# EAGLE design MotherBoard rev1 (EAGLE 9.1.3)
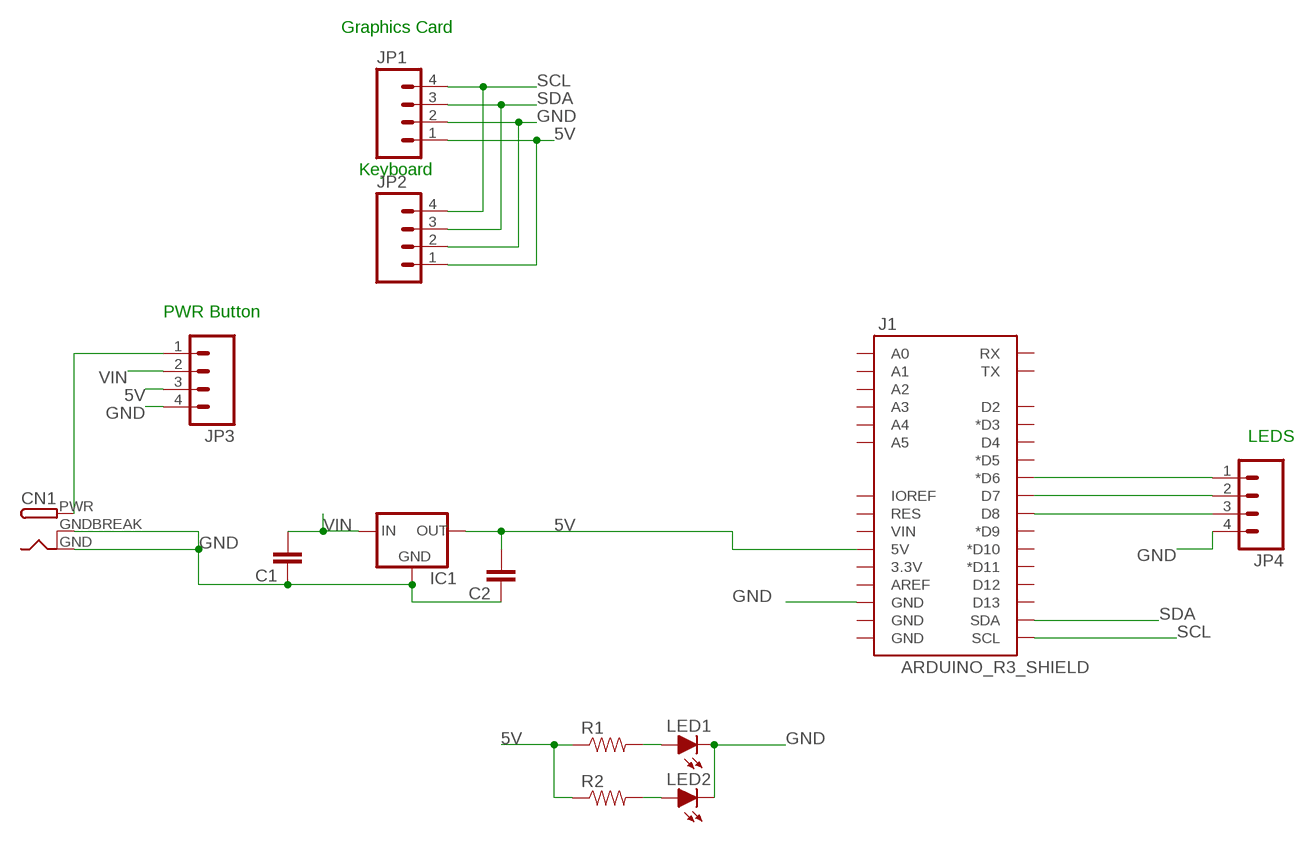
[diagram p0: schematic, sheet 1]

## Parts
C1  CAPPTH3  [CAP-PTH-LARGE]
C2  CAPPTH3  [CAP-PTH-LARGE]
CN1  DCBARRELPTH  [DCJACK_2MM_PTH]
IC1  5VREG_L7805SPACED  [TO-220-SPACED]
J1  ARDUINO_R3_SHIELD  [UNO_R3_SHIELD]
JP1  M04  [1X04]
JP2  M04  [1X04]
JP3  M04  [1X04]
JP4  M04  [1X04]
LED1  LED-5MM  [LED-5MM]
LED2  LED-5MM  [LED-5MM]
R1  RESISTORPTH-1/2W  [AXIAL-0.5]
R2  RESISTORPTH-1/2W  [AXIAL-0.5]

## Nets
5V: C2.2 IC1.3(OUT) J1.5V JP1.1 JP2.1 JP3.3 R1.P$1 R2.P$1
GND: C1.1 C2.1 CN1.GND CN1.GNDBREAK IC1.2(GND) J1.GND@2(GND) JP1.2 JP2.2 JP3.4 JP4.4 LED1.K(C) LED2.K(C)
N$1: LED1.A R1.P$2
N$2: LED2.A R2.P$2
N$3: CN1.PWR JP3.1
N$5: J1.D8 JP4.3
N$6: J1.D6(*D6) JP4.1
N$7: J1.D7 JP4.2
SCL: J1.SCL JP1.4 JP2.4
SDA: J1.SDA JP1.3 JP2.3
VIN: C1.2 IC1.1(IN) JP3.2
Unconnected: J1.3.3V J1.A0 J1.A1 J1.A2 J1.A3 J1.A4 J1.A5 J1.AREF J1.D2 J1.D3(*D3) J1.D4 J1.D5(*D5) J1.D9(*D9) J1.D10(*D10) J1.D11(*D11) J1.D12 J1.D13 J1.GND@0(GND) J1.GND@1(GND) J1.IOREF J1.RES J1.RX J1.TX J1.VIN

## Notes on the sheet
- Graphics Card
- Keyboard
- PWR Button
- LEDS

## Library data of the parts
C1 C2 = HyTechDevices:CAP: Capacitor Standard 0603 ceramic capacitor, and 0.1" leaded capacitor.
CN1 = HyTechDevices:DCBARREL: 2.0mm DC Barrel Jack DCJACK_2MM_PTH - Through Hole Jack (4UConnector: 05537) Source: Adafruit <https://github.com/adafruit/Adafruit-Eagle-Library>
IC1 = HyTechDevices:5VREG_L7805: Voltage Regulator Switching 5v regulator Datasheet <http://power.murata.com/data/power/oki-78sr.pdf> Standard 7805 5V regulator. IGO (Input Ground Output). Spark Fun Electronics SKU : COM-00107 Datasheet <http://www.mouser.com/ds/2/308/MC7800-D-94905.pdf>
J1 = HyTechDevices:ARDUINO_R3_SHIELD: Shield form compatible with the Arduino Uno R3. Source: Sparkfun <https://github.com/sparkfun/SparkFun-Eagle-Libraries>
JP1-JP4 = HyTechDevices:M04: Standard 4-pin 0.1" header. NOTES ON THE VARIANTS LOCK and LOCK_LONGPADS... This footprint was designed to help hold the alignment of a through-hole component (i.e. 6-pin header) while soldering it into place. You may notice that each hole has been shifted either up or down by 0.005 of an inch from it's more standard position (which is a perfectly straight line). This slight alteration caused the pins (the squares in the middle) to touch the edges of the holes. Because they are alternating, it causes a "brace" to hold the component in place. 0.005 has proven to be the perfect amount of "off-center" position when using our standard breakaway headers. Although looks a little odd when you look at the bare footprint, once you have a header in there, the alteration is very hard to notice. Also,if you push a header all the way into place, it is covered up entirely on the bottom side. This idea of altering the position of holes to aid alignment will be further integrated into the Sparkfun Library for other footprints. It can help hold any component with 3 or more connection pins. Note: The Sparkfun version includes many other packages including surface mount that may be of future interest. Source: Sparkfun <https://github.com/sparkfun/SparkFun-Eagle-Libraries>
LED1 LED2 = HyTechDevices:LED: Light Emitting Diode (LED) Source: Dangerous Prototypes Eagle Library <https://github.com/DangerousPrototypes/Eagle_Part_Library>
R1 R2 = HyTechDevices:RESISTOR: Resistor Basic schematic elements and footprints for 0603, 1206, and PTH resistors.

## Board
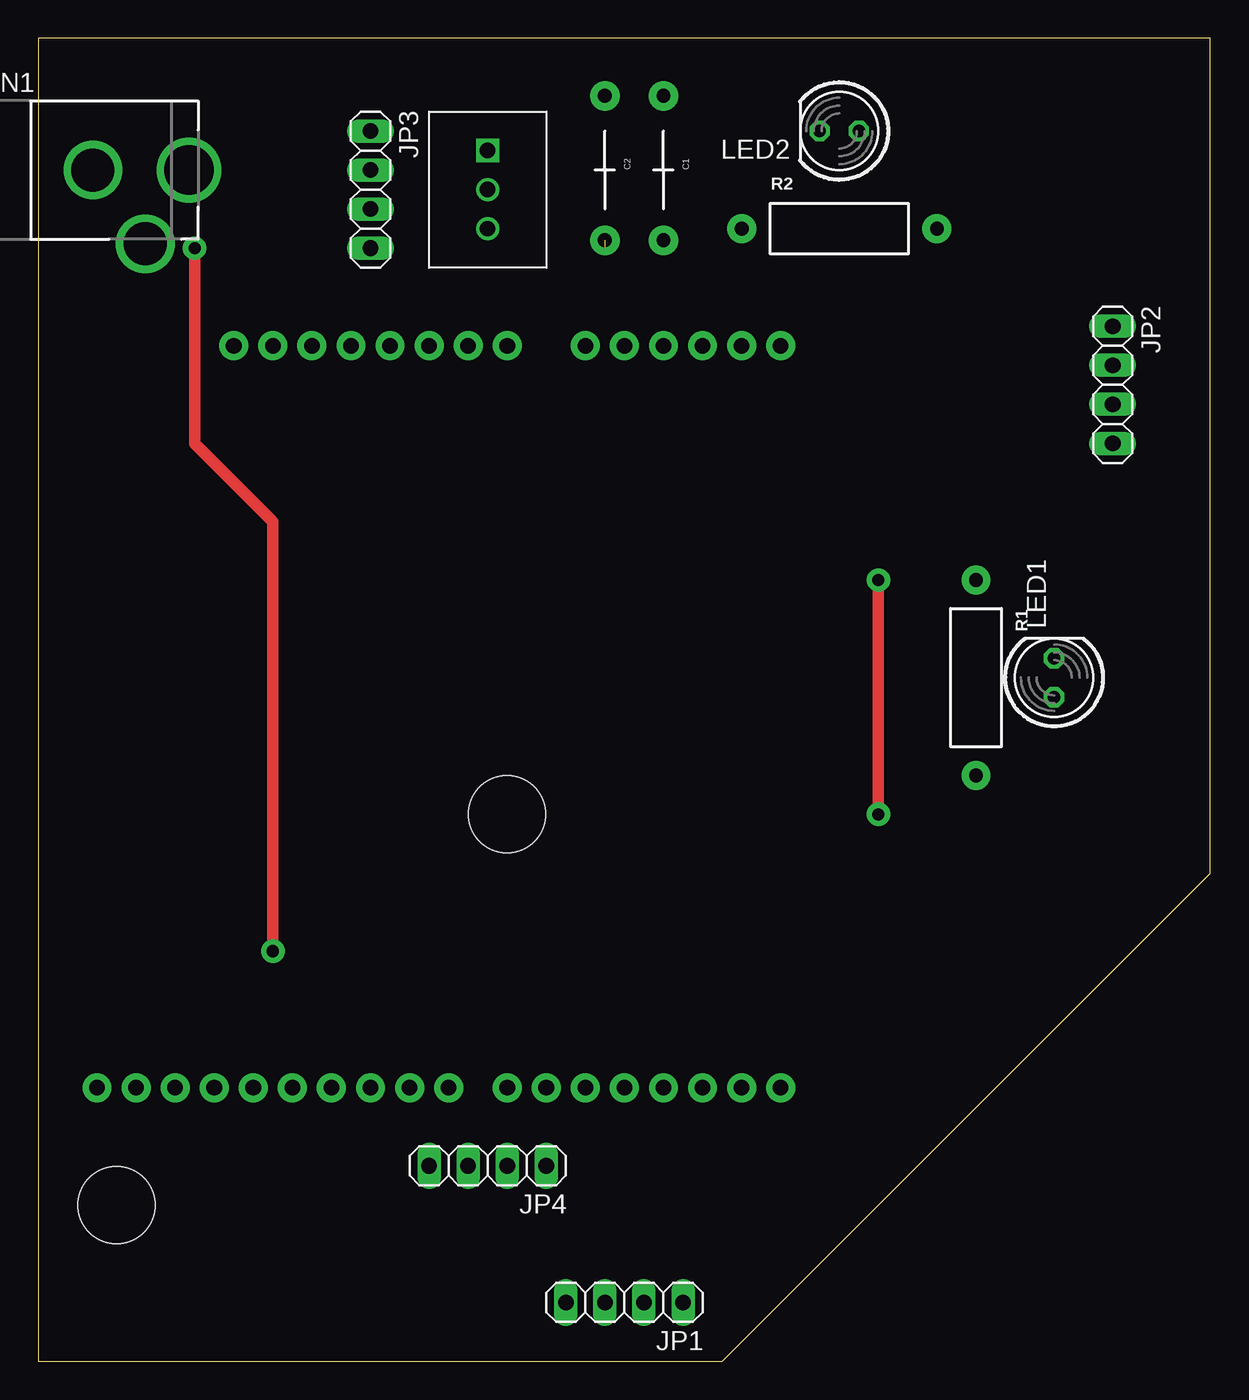
[diagram p1: board, top side]
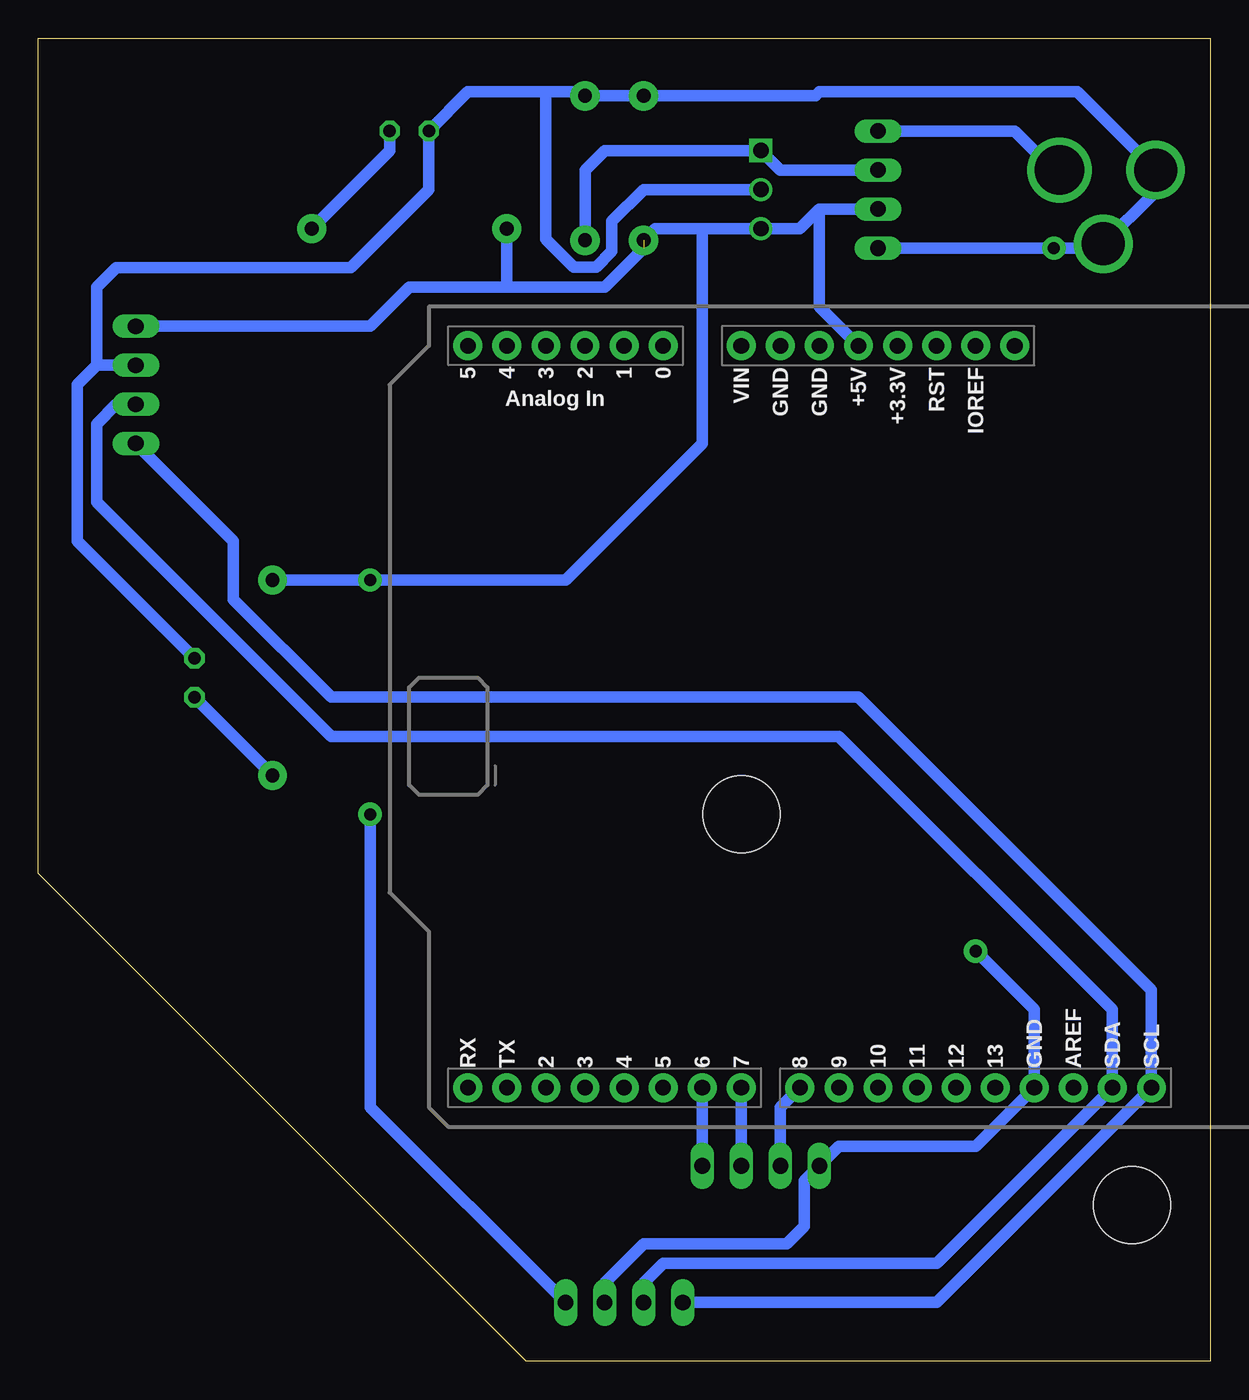
[diagram p2: board, bottom side, seen from below]

Size 76.18 x 86.03 mm. Coordinates in mm from the lower left corner, seen from the top.
Outline: 0,0 44.45,0 76.18,31.73 76.18,86.03 0,86.03 0,0
Copper layers (1*16): Top 0.035mm / dielectric 1.5mm / Bottom 0.035mm
Design rules "default *": minimum track width 6mil, minimum drill 0.35mm, track to track 16mil, track to pad 16mil, pad to pad 16mil, via to via 16mil, smd to smd 16mil, copper to edge 40mil, drill to drill 6mil, minimum pad ring 10mil, minimum via ring 8mil, stop-mask expansion 4mil, vias tented up to drill 0mil, thermal gap 10mil
Holes 0.35 mm at 80.01,38.1
Holes 5 mm at 5.08,10.16 30.48,35.56

### Footprints (pad centres in the part's own frame; a part is rotated, then mirrored left to right if it is on the bottom)
CAP-PTH-LARGE = drill 0.9 pad 1.905: 1 -4.826,0; 2 4.572,0
DCJACK_2MM_PTH = drill 2.8: GND 0,7.35; GNDBREAK 4.8,10.75 | drill 3.2: PWR 0,13.6
TO-220-SPACED = drill 1 square: 1 -2.54,0 | drill 1: 2 0,0; 3 2.54,0
UNO_R3_SHIELD = drill 1.016 pad 1.88: 3.3V 50.8,26.67; 5V 50.8,29.21; A0 50.8,41.91; A1 50.8,44.45; A2 50.8,46.99; A3 50.8,49.53; A4 50.8,52.07; A5 50.8,54.61; AREF 2.54,15.24; D2 2.54,49.53; D3 2.54,46.99; D4 2.54,44.45; D5 2.54,41.91; D6 2.54,39.37; D7 2.54,36.83; D8 2.54,33.02; D9 2.54,30.48; D10 2.54,27.94; D11 2.54,25.4; D12 2.54,22.86; D13 2.54,20.32; GND@0 50.8,31.75; GND@1 50.8,34.29; GND@2 2.54,17.78; IOREF 50.8,21.59; NC 50.8,19.05; RES 50.8,24.13; RX 2.54,54.61; SCL 2.54,10.16; SDA 2.54,12.7; TX 2.54,52.07; VIN 50.8,36.83
1X04 = drill 1.016 long: 1 -3.81,0; 2 -1.27,0; 3 1.27,0; 4 3.81,0
LED-5MM = drill 0.813 octagon: A -1.27,0; K 1.27,0
AXIAL-0.5 = drill 0.9 pad 1.88: P$1 -6.35,0; P$2 6.35,0

### Placement (x,y rotation side)
C1  40.64,77.47 270 top
C2  36.83,77.47 270 top
CN1  -3.81,77.47 270 top
IC1  29.21,76.2 270 top
J1  -6.35,15.24 90 bottom
JP1  38.1,3.81 180 top
JP2  69.85,63.5 270 top
JP3  21.59,76.2 270 top
JP4  29.21,12.7 180 top
LED1  66.04,44.45 90 top
LED2  52.07,80.01 180 top
R1  60.96,44.45 270 top
R2  52.07,73.66 0 top

### Tracks (layer width: path | path; a pad name or v marks a point on that pad's centre or on a via)
5V  (via drill 0.8 pad 1.52)  (1 unrouted)
  Top 0.762: v54.61,35.56 v54.61,50.8
  Bottom 0.762: 25.4,74.93 26.67,73.66 IC1.3 33.02,73.66 | 25.4,74.93 JP3.3 | J1.5V 25.4,68.58 25.4,74.93 | 33.02,73.66 36.07,73.66 C2.2 | 36.83,72.39 39.37,69.85 43.18,69.85 45.72,69.85 | 33.02,73.66 33.02,59.69 41.91,50.8 v54.61,50.8 R1.P$1 | JP2.1 54.61,67.31 52.07,69.85 45.72,69.85 | R2.P$1 45.72,69.85 | JP1.1 54.61,16.51 v54.61,35.56
GND  (via drill 0.8 pad 1.52)
  Top 0.762: v15.24,26.67 15.24,54.61 10.16,59.69 v10.16,72.39
  Bottom 0.762: JP3.4 v10.16,72.39 8.62,72.39 8.34,72.67 CN1.GNDBREAK 3.67,75.94 3.67,77.61 | CN1.GND 3.67,77.61 | 3.67,77.61 8.62,82.55 25.4,82.55 25.65,82.3 C2.1 C1.1 40.89,82.55 43.18,82.55 | LED1.K 73.66,53.34 73.66,63.5 72.39,64.77 | 72.39,64.77 JP2.2 | v15.24,26.67 11.43,22.86 J1.GND@2 15.24,13.97 24.13,13.97 JP4.4 26.39,11.71 26.39,8.76 27.53,7.62 36.83,7.62 39.37,5.08 JP1.2 | 72.39,64.77 | 72.39,64.77 72.39,69.85 71.12,71.12 58.42,71.12 55.88,71.12 50.8,76.2 LED2.K 48.26,82.55 43.18,82.55 | IC1.2 36.83,76.2 38.9,74.13 38.9,72.18 39.92,71.16 41.36,71.16 43.18,72.98 43.18,82.55
N$1
  Bottom 0.762: R1.P$2 LED1.A
N$2
  Bottom 0.762: R2.P$2 53.34,78.74 LED2.A
N$3
  Bottom 0.762: CN1.PWR 10.16,77.47 12.7,80.01 JP3.1
N$5
  Bottom 0.762: J1.D8 27.94,16.51 JP4.3
N$6
  Bottom 0.762: J1.D6 JP4.1
N$7
  Bottom 0.762: J1.D7 JP4.2
SCL
  Bottom 0.762: JP2.4 63.5,53.34 63.5,49.53 57.15,43.18 22.86,43.18 3.81,24.13 J1.SCL 15.24,6.35 15.88,5.71 | 15.88,5.71 16.51,5.08 | JP1.4 17.78,3.81 15.88,5.71
SDA
  Bottom 0.762: JP2.3 71.12,62.23 72.39,60.96 72.39,55.88 57.15,40.64 24.13,40.64 6.35,22.86 J1.SDA 17.78,6.35 35.56,6.35 36.83,5.08 JP1.3
VIN
  Bottom 0.762: JP3.2 25.4,77.47 27.94,77.47 IC1.1 39.37,78.74 40.64,77.47 C1.2